# EAGLE design POVBase (EAGLE 8.6.3)
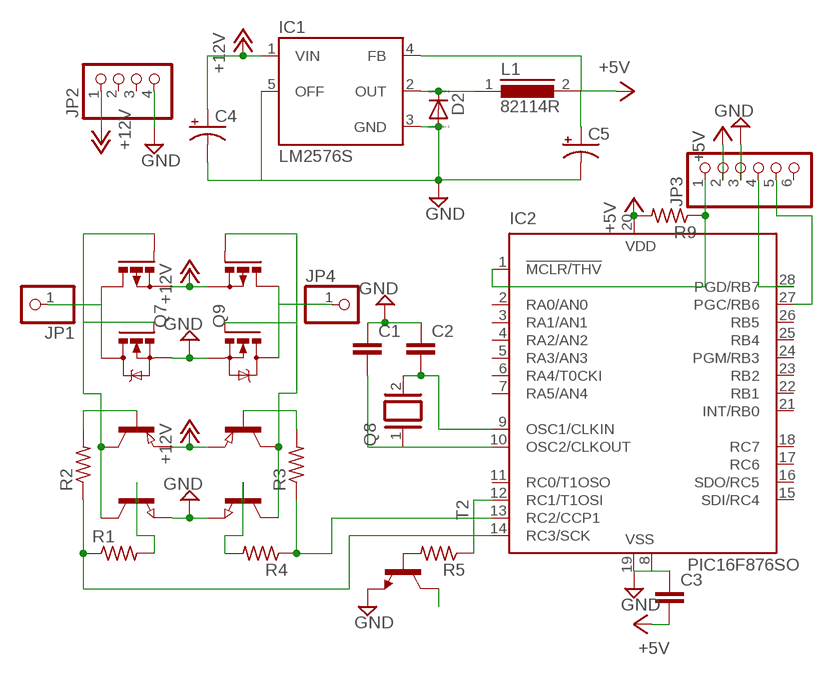
[diagram p0: schematic, sheet 1]

## Parts
C1  C-EUC0805  [C0805]
C2  C-EUC0805  [C0805]
C3  C-EUC0805  [C0805]
C4  CPOL-USE2.5-7  [E2,5-7]
C5  CPOL-USE1.8-4  [E1,8-4]
D2  DIODE_E-SMC  [DIODE_SMC]
IC1  LM2576S  [TO263-5]
IC2  PIC16F876SO  [SO28W]
JP1  PINHD-1X1  [1X01]
JP2  PINHD-1X4  [1X04]
JP3  PINHD-1X6  [1X06]
JP4  PINHD-1X1  [1X01]
L1  82114R  [82114R]
Q1  NPN-TRANSISTOR_SOT23  [SOT23]
Q2  NPN-TRANSISTOR_SOT23  [SOT23]
Q3  PNP-TRANSISTOR_SOT23  [SOT23]
Q4  PNP-TRANSISTOR_SOT23  [SOT23]
Q5  IRF540  [TO220BV]
Q6  IRF540  [TO220BV]
Q7  PMOSFET_PTO220BV  [TO220BV]
Q8  XTAL/S  [QS]
Q9  PMOSFET_PTO220BV  [TO220BV]
R1  R-US_R0805  [R0805]
R2  R-US_R0805  [R0805]
R3  R-US_R0805  [R0805]
R4  R-US_R0805  [R0805]
R5  R-US_R0805  [R0805]
R9  R-US_R0805  [R0805]
T2  2SC1306  [TO220BV]

## Nets
+5V: C3.2 C5.+ IC1.4(FB) IC2.20(VDD) JP3.2 L1.2 R9.2
+12V: C4.+ IC1.1(VIN) JP2.1 Q3.2(E) Q4.2(E) Q7.S Q9.S
GND: C1.1 C2.1 C3.1 C4.- C5.- D2.A(C) IC1.3(GND) IC1.5(OFF) IC2.8(VSS) IC2.19(VSS) JP2.4 JP3.3 Q1.2(E) Q2.2(E) Q5.S Q6.S T2.3(E)
N$1: Q1.3(C) Q3.3(C) Q5.G Q7.G
N$2: Q1.1(B) R1.2
N$3: Q2.1(B) R4.2
N$4: Q2.3(C) Q4.3(C) Q6.G Q9.G
N$5: Q3.1(B) R2.2
N$6: Q4.1(B) R3.2
N$7: IC2.14(RC3/SCK) R1.1 R2.1
N$8: IC2.13(RC2/CCP1) R3.1 R4.1
N$10: JP4.1 Q6.D Q9.D
N$11: JP1.1 Q5.D Q7.D
N$12: IC2.1(!MCLR/THV) JP3.1 R9.1
N$13: IC2.28(PGD/RB7) JP3.4
N$14: IC2.27(PGC/RB6) JP3.5
N$15: D2.C(A) IC1.2(OUT) L1.1
N$16: C1.2 IC2.10(OSC2/CLKOUT) Q8.1
N$17: C2.2 IC2.9(OSC1/CLKIN) Q8.2
N$20: T2.2(C)
N$21: IC2.12(RC1/T1OSI) R5.1
N$22: R5.2 T2.1(B)
Unconnected: IC2.2(RA0/AN0) IC2.3(RA1/AN1) IC2.4(RA2/AN2) IC2.5(RA3/AN3) IC2.6(RA4/T0CKI) IC2.7(RA5/AN4) IC2.11(RC0/T1OSO) IC2.15(SDI/RC4) IC2.16(SDO/RC5) IC2.17(RC6) IC2.18(RC7) IC2.21(INT/RB0) IC2.22(RB1) IC2.23(RB2) IC2.24(PGM/RB3) IC2.25(RB4) IC2.26(RB5) JP2.2 JP2.3 JP3.6

## Library data of the parts
C1-C3 = resistor:C-EU: CAPACITOR, European symbol
C4 C5 = rcl:CPOL-US: POLARIZED CAPACITOR, American symbol; SPICEPREFIX: C
D2 = eagle-ltspice:DIODE_E-: Schottky Diode; SPICEMODEL: diode; SPICEPREFIX: D
IC1 = lm2576:LM2576: National Semiconductor <http://www.national.com> 3.0A "Simple Switcher"(c) 52kHz, Vout 1.23-37V (HV: 57V), Vin 40V (HV: 60V), 50µA standby current
IC2 = microchip:PIC16*876: MICROCONTROLLER flash type; MF: MICROCHIP; MPN: PIC16F876-20/SO; OC_FARNELL: 9761268; OC_NEWARK: 12C1950
JP1 JP4 = pinhead:PINHD-1X1: PIN HEADER
JP2 = pinhead:PINHD-1X4: PIN HEADER
JP3 = pinhead:PINHD-1X6: PIN HEADER
L1 = inductors:82114R: INDUCTOR; SPICEPREFIX: L
Q1 Q2 = semicon-smd-ipc:NPN-TRANSISTOR_: NPN TRANSISTOR
Q3 Q4 = semicon-smd-ipc:PNP-TRANSISTOR_: PNP TRANSISTOR
Q5 Q6 = transistor-power:IRF540: HEXFET Power MOSFET
Q7 Q9 = transistor-power:PMOSFET_P: Power MOSFET P-Channel
Q8 = special:XTAL/S: CRYSTAL
R1-R5 R9 = resistor:R-US_: RESISTOR, American symbol
T2 = transistor:2SC1306: NPN Transistor Final RF Power Outupt Source: 2sc1306.pdf

## Board
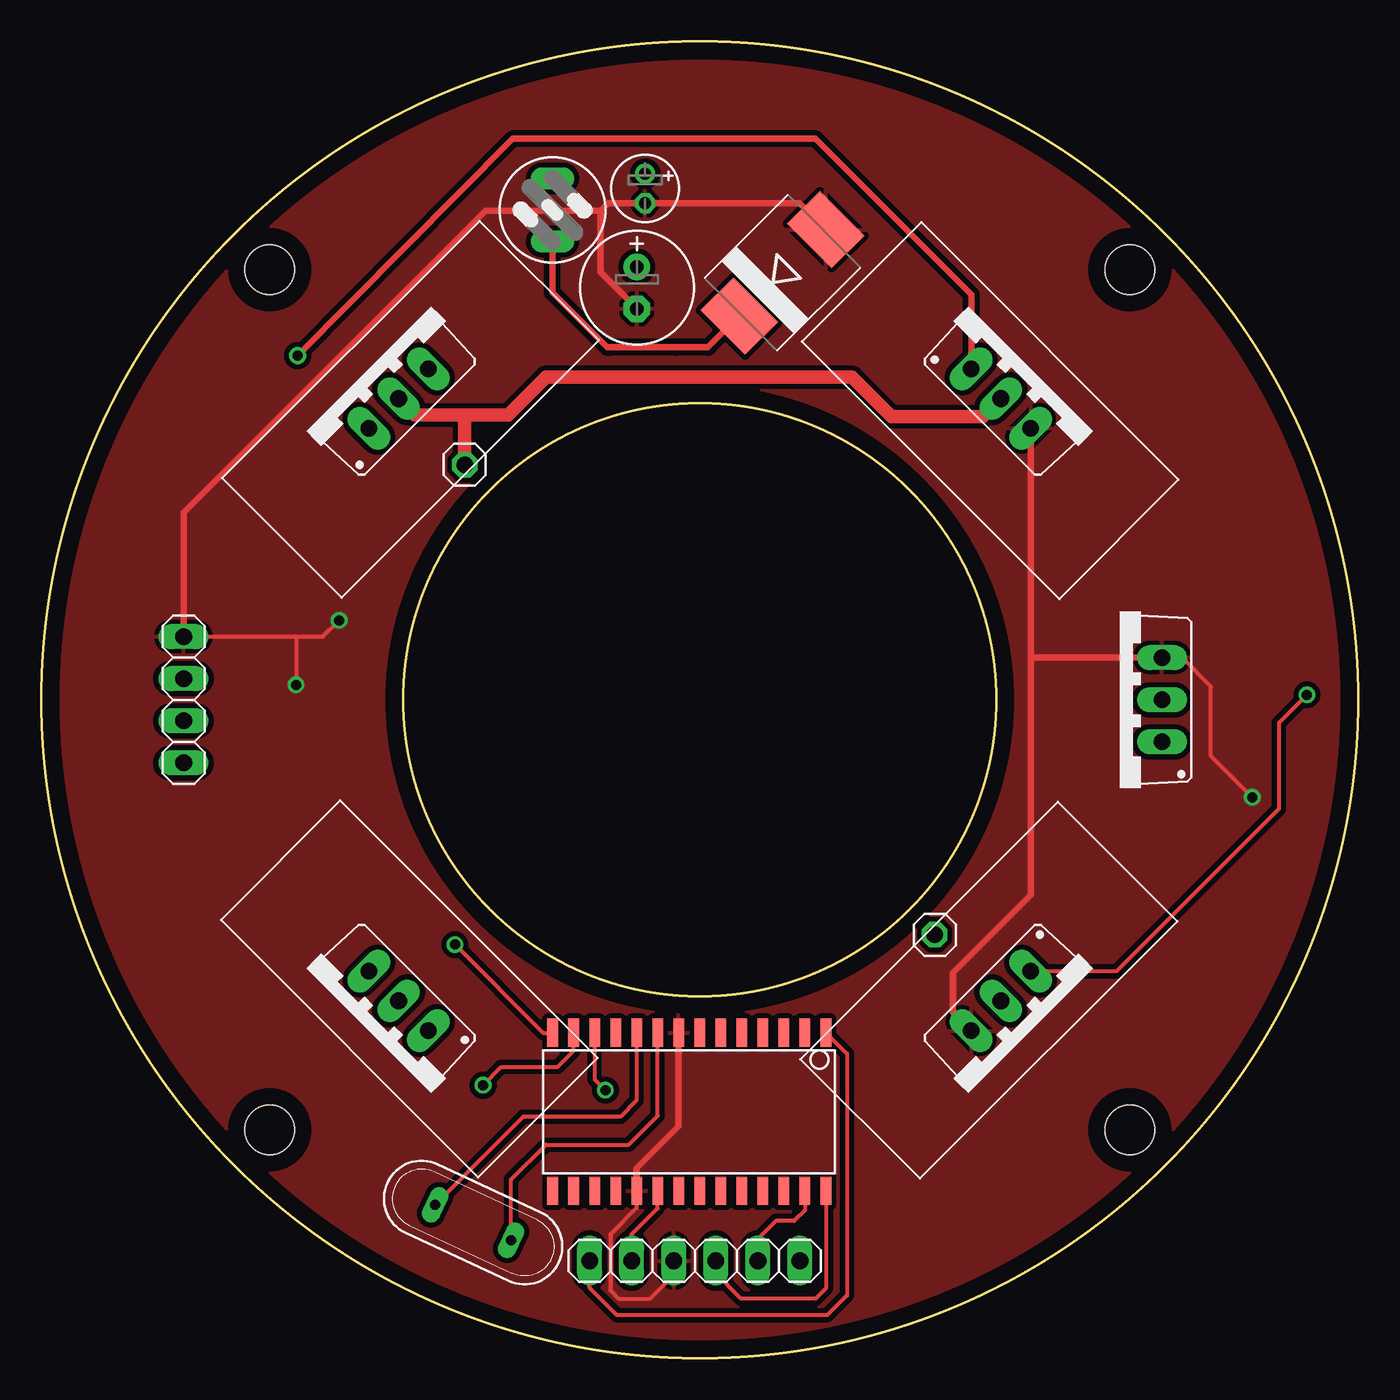
[diagram p1: board, top side]
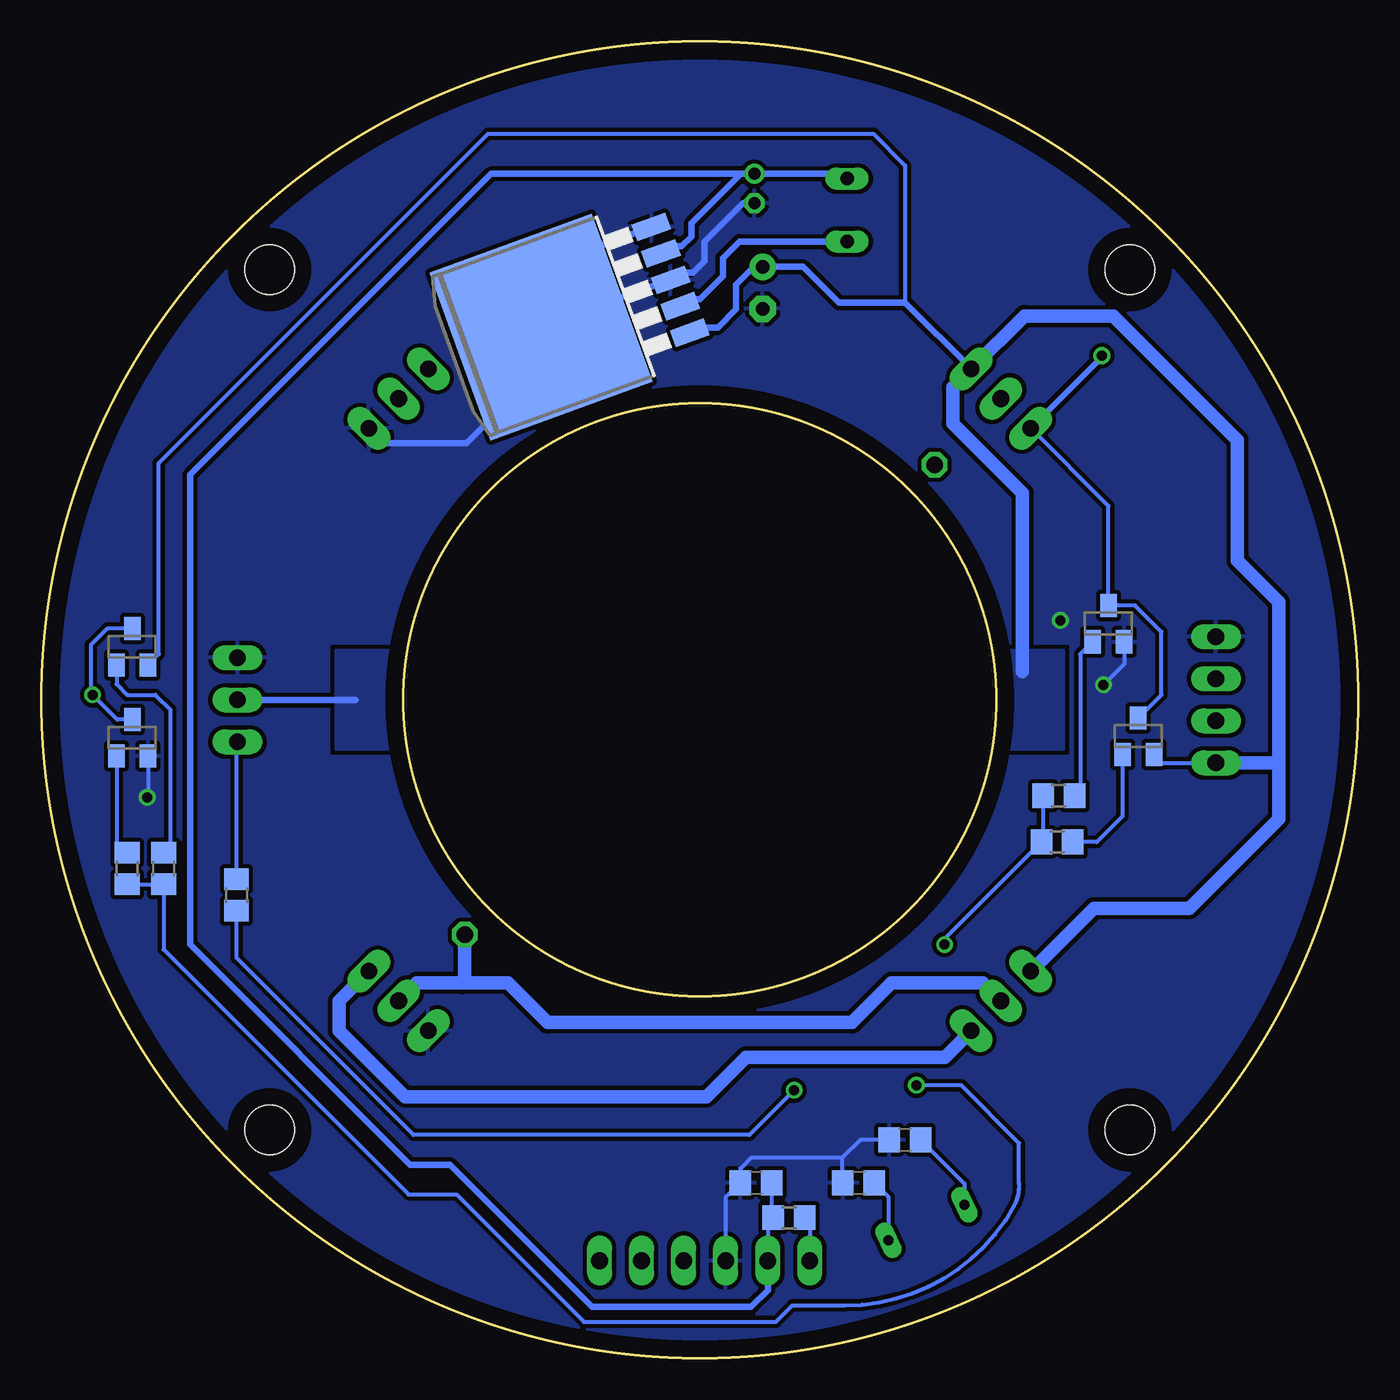
[diagram p2: board, bottom side, seen from below]

Size 79.58 x 79.58 mm. Coordinates in mm from the lower left corner, seen from the top.
Outline: circle at 39.79,39.79 radius 17.9
Outline: circle at 39.79,39.79 radius 39.79
Copper layers (1*16): Top 0.035mm / dielectric 1.5mm / Bottom 0.035mm
Design rules "default *": minimum track width 0.1mm, minimum drill 24mil, track to track 8mil, track to pad 8mil, pad to pad 8mil, via to via 8mil, smd to smd 8mil, copper to edge 40mil, drill to drill 8mil, minimum pad ring 10mil, minimum via ring 8mil, stop-mask expansion 4mil, vias tented up to drill 0mil, thermal gap 10mil
Holes 3 mm at 65.79,65.79 13.79,65.79 13.79,13.79 65.79,13.79
Holes 35.8 mm at 39.79,39.79

### Footprints (pad centres in the part's own frame; a part is rotated, then mirrored left to right if it is on the bottom)
C0805 = smd 1.3 x 1.5: 1 -0.95,0; 2 0.95,0
E2,5-7 = drill 0.813 pad 1.6: + -1.27,0 | drill 0.813 pad 1.6 octagon: - 1.27,0
E1,8-4 = drill 0.711 pad 1.168: + -0.889,0 | drill 0.711 pad 1.168 octagon: - 0.889,0
DIODE_SMC = smd 2.8 x 3.8: A 3.7,0; C -3.7,0
TO263-5 = smd 1.067 x 2.159: 1 -3.404,-5.791; 2 -1.702,-5.791; 3 0,-5.791; 4 1.702,-5.791; 5 3.404,-5.791 | smd 10.8 x 10.41: 6 0,2.54
SO28W = smd 0.65 x 1.7: 1 -7.62,-4.78; 2 -6.35,-4.78; 3 -5.08,-4.78; 4 -3.81,-4.78; 5 -2.54,-4.78; 6 -1.27,-4.78; 7 0,-4.78; 8 1.27,-4.78; 9 2.54,-4.78; 10 3.81,-4.78; 11 5.08,-4.78; 12 6.35,-4.78; 13 7.62,-4.78; 14 8.89,-4.78; 15 8.89,4.78; 16 7.62,4.78; 17 6.35,4.78; 18 5.08,4.78; 19 3.81,4.78; 20 2.54,4.78; 21 1.27,4.78; 22 0,4.78; 23 -1.27,4.78; 24 -2.54,4.78; 25 -3.81,4.78; 26 -5.08,4.78; 27 -6.35,4.78; 28 -7.62,4.78
1X01 = drill 1.016 octagon: 1 0,0
1X04 = drill 1.016 long: 1 -3.81,0; 2 -1.27,0; 3 1.27,0; 4 3.81,0
1X06 = drill 1.016 long: 1 -6.35,0; 2 -3.81,0; 3 -1.27,0; 4 1.27,0; 5 3.81,0; 6 6.35,0
82114R = drill 0.813 long: 1 0,1.905; 2 0,-1.905
SOT23 = smd 1 x 1.4: 1 -0.95,-1.1; 2 0.95,-1.1; 3 0,1.1
TO220BV = drill 1.016 long: D 0,-2.54; G -2.54,-2.54; S 2.54,-2.54
QS = drill 0.61 long: 1 -2.54,0; 2 2.54,0
R0805 = smd 1.3 x 1.5: 1 -0.95,0; 2 0.95,0
TO220BV' = drill 1.016 long: 1 -2.54,-2.54; 2 0,-2.54; 3 2.54,-2.54

### Placement (x,y rotation side)
C1  27.39,13.19 0 bottom
C2  30.19,10.59 0 bottom
C3  36.39,10.59 0 bottom
C4  35.99,64.69 270 top
C5  36.49,70.69 270 top
D2  44.79,65.59 45 top
IC1  46.99,63.19 110 bottom
IC2  39.79,14.89 180 top
JP1  25.59,53.99 0 top
JP2  8.59,39.79 90 top
JP3  39.49,5.89 0 top
JP4  53.99,25.59 0 top
L1  30.89,69.39 180 top
Q1  15.09,44.39 0 bottom
Q2  74.09,37.49 0 bottom
Q3  13.29,37.59 0 bottom
Q4  74.09,42.99 0 bottom
Q5  59.79,59.79 315 top
Q6  59.79,19.79 225 top
Q7  19.79,59.79 45 top
Q8  26.09,8.19 335 top
Q9  19.79,19.79 135 top
R1  18.09,33.99 0 bottom
R2  18.19,31.19 0 bottom
R3  72.19,29.59 90 bottom
R4  74.39,29.59 90 bottom
R5  67.79,27.99 90 bottom
R9  34.39,8.49 180 bottom
T2  2SC1306  [TO220BV']  65.19,39.79 90 top

### Tracks (layer width: path | path; a pad name or v marks a point on that pad's centre or on a via)
+5V
  Top 0.254: JP3.2 35.68,7.48 37.25,9.05 IC2.20
  Bottom 0.254: C3.2 35.44,8.59 R9.2 35.68,8.15 35.68,6.09 JP3.2
  Bottom 0.406: IC1.4 41.91,66.77 41.49,67.19 40.89,67.19 40.29,67.79 40.29,68.59 37.3,71.58 | 37.3,71.58 C5.+ 31.18,71.58 L1.2 | 37.3,71.58 52.4,71.58 70.59,53.39 70.59,24.99 57.29,11.69 54.89,11.69 46.29,3.09 36.69,3.09 35.68,4.1 35.68,6.09
+12V
  Bottom 0.254: Q3.2 11.83,35.98 JP2.1 | Q4.2 72.49,42.54 72.49,54.09 52.59,73.99 29.29,73.99 27.38,72.08 27.38,63.79
  Bottom 0.406: IC1.1 39.98,61.97 39.66,62.29 38.69,62.29 37.59,63.39 37.59,64.89 36.52,65.96 C4.+ 33.56,65.96 31.39,63.79 27.38,63.79 Q7.S
  Bottom 0.813: 4.79,35.99 4.79,45.69 7.29,48.19 7.29,55.49 14.79,62.99 20.18,62.99 Q7.S 24.49,58.68 24.49,56.49 20.29,52.29 20.29,41.49 | 4.79,35.99 4.79,32.59 10.19,27.19 15.98,27.19 Q9.S | JP2.1 4.8,35.98 4.79,35.99
  pour Bottom: 21.79,42.79 17.79,42.79 17.79,36.79 21.79,36.79
GND  (via drill 0.6)
  Top 0.254: IC2.19 35.98,9.08 34.39,7.49 34.39,4.09 34.89,3.59 36.79,3.59 38.22,5.02 JP3.3 | v73.19,33.89 70.69,36.39 70.69,40.59 68.95,42.33 T2.3 | JP2.4 15.39,43.6 | 15.39,43.6 17,43.6 v17.99,44.59 | 15.39,43.6 v15.39,40.69
  Top 0.406: D2.A 45.81,69.8 C5.- 34.25,69.8 33.79,69.34 | IC2.19 35.98,11.48 38.52,14.02 IC2.8 | C4.- 33.79,65.62 33.79,69.34 | JP2.4 8.59,51.09 26.84,69.34 33.79,69.34 | T2.3 59.79,42.33 | 59.79,42.33 Q5.S | Q6.S 55.09,20.9 55.09,23.29 59.79,27.99 59.79,42.33
  Bottom 0.254: C1.1 30.09,13.19 31.19,12.09 | 31.19,12.09 31.19,10.64 C2.1 | JP3.3 38.22,9.71 C3.1 37.34,11.44 36.69,12.09 31.19,12.09 | Q1.2 14.14,41.94 v15.39,40.69 | Q2.2 73.14,33.94 v73.19,33.89
  Bottom 0.406: 45.39,63.79 IC1.3 41.13,65.59 40.19,65.59 39.49,66.29 39.49,67.49 37.18,69.8 C5.- | 45.39,63.79 46.59,66.89 IC1.5 | 45.39,63.79 53.89,55.29 58.88,55.29 Q5.S
  pour Bottom (isolate 0.254, rank 3): 39.69,-0.01 arc-90 -0.01,39.69 -0.01,39.79 arc-90 39.79,79.59 39.89,79.59 arc-90 79.59,39.89 79.59,39.79 arc-90
  pour Top (isolate 0.305): 39.79,-0.01 arc-90 -0.01,39.69 arc-90 39.89,79.59 39.99,79.59 arc-90 79.59,39.99 79.59,39.79 arc-90
N$1  (via drill 0.6)
  Top 0.406: Q5.G 56.2,64.28 46.79,73.69 28.49,73.69 v15.49,60.59
  Bottom 0.254: Q7.G 15.09,51.5 Q1.3 13.49,45.49 11.89,43.89 11.89,40.09 Q3.3
  Bottom 0.406: Q7.G 15.49,60.5 v15.49,60.59
N$2
  Bottom 0.254: Q1.1 16.79,42.54 16.79,34.34 R1.2
N$3
  Bottom 0.254: R4.2 75.04,31.19 Q2.1
N$4  (via drill 0.6)
  Top 0.254: v76.49,40.09 74.79,38.39 74.79,33.19 64.98,23.38 Q6.G
  Bottom 0.254: Q4.3 75.59,44.09 76.59,43.09 76.59,40.19 v76.49,40.09 74.99,38.59 Q2.3
  Bottom 0.813: Q6.G 61.59,21.58 61.59,19.79 57.59,15.79 39.39,15.79 36.99,18.19 24.98,18.19 Q9.G
N$5
  Bottom 0.254: Q3.1 14.24,32.74 15.79,31.19 R2.2
N$6
  Bottom 0.254: Q4.1 75.04,40.74 74.39,40.09 72.69,40.09 71.79,39.19 71.79,30.94 R3.2
N$7  (via drill 0.6)
  Top 0.254: v24.99,24.99 30.31,19.67 IC2.14
  Bottom 0.254: R1.1 19.04,31.29 R2.1 24.99,25.34 v24.99,24.99
N$8  (via drill 0.6)
  Top 0.254: v26.69,16.49 27.79,17.59 31.19,17.59 32.17,18.57 IC2.13
  Bottom 0.254: R4.1 R3.1 72.19,24.69 57.39,9.89 54.49,9.89 46.79,2.19 35.19,2.19 34.19,3.19 30.99,3.19 arc-61 20.79,9.19 arc-34 20.49,10.59 20.49,12.99 23.99,16.49 v26.69,16.49
N$10
  Bottom 0.813: Q9.D 22.69,22.69 28.19,22.69 30.59,20.29 48.99,20.29 51.39,22.69 53.99,22.69 | Q6.D 56.89,22.69 54.29,22.69 53.99,22.69 | 53.99,22.69 JP4.1
N$11
  Top 0.813: Q5.D 56.89,56.89 51.39,56.89 48.99,59.29 30.49,59.29 28.19,56.99 25.89,56.99 25.59,56.99 | Q7.D 22.59,56.99 25.59,56.99 | 25.59,56.99 JP1.1
N$12
  Top 0.254: IC2.1 48.69,18.39 48.69,8.99 48.69,3.79 47.49,2.59 34.79,2.59 33.14,4.24 JP3.1
  Bottom 0.254: R9.1 33.14,8.19 JP3.1
N$13
  Top 0.254: IC2.28 47.41,4.21 46.79,3.59 42.29,3.59 40.76,5.12 JP3.4
N$14
  Top 0.254: IC2.27 46.14,8.94 45.49,8.29 44.39,8.29 43.3,7.2 JP3.5
N$15
  Top 0.406: D2.C 40.29,61.09 38.39,61.09 34.39,61.09 34.19,61.09 33.99,61.29 30.89,64.39 L1.1
  Bottom 0.406: IC1.2 40.55,63.99 39.79,63.99 38.39,65.39 38.39,66.49 37.4,67.49 L1.1
N$16
  Top 0.254: IC2.10 35.98,15.58 34.99,14.59 29.12,14.59 Q8.1
  Bottom 0.254: C1.2 23.79,10.54 Q8.1
N$17
  Top 0.254: Q8.2 28.39,10.79 30.49,12.89 35.49,12.89 37.25,14.65 IC2.9
  Bottom 0.254: C2.2 28.39,9.74 Q8.2
N$20
  Bottom 0.406: T2.2 60.59,39.79
  pour Bottom: 57.79,39.79 57.79,42.79 61.79,42.79 61.79,36.79 57.79,36.79
N$21  (via drill 0.6)
  Top 0.254: v34.09,16.19 33.44,16.84 IC2.12
  Bottom 0.254: v34.09,16.19 36.79,13.49 57.09,13.49 67.79,24.19 R5.1
N$22
  Bottom 0.254: R5.2 67.79,37.19 T2.1